# Altium schematic sheet Sensors5V.SchDoc
size A; SheetNumber: 3; SheetTotal: 5
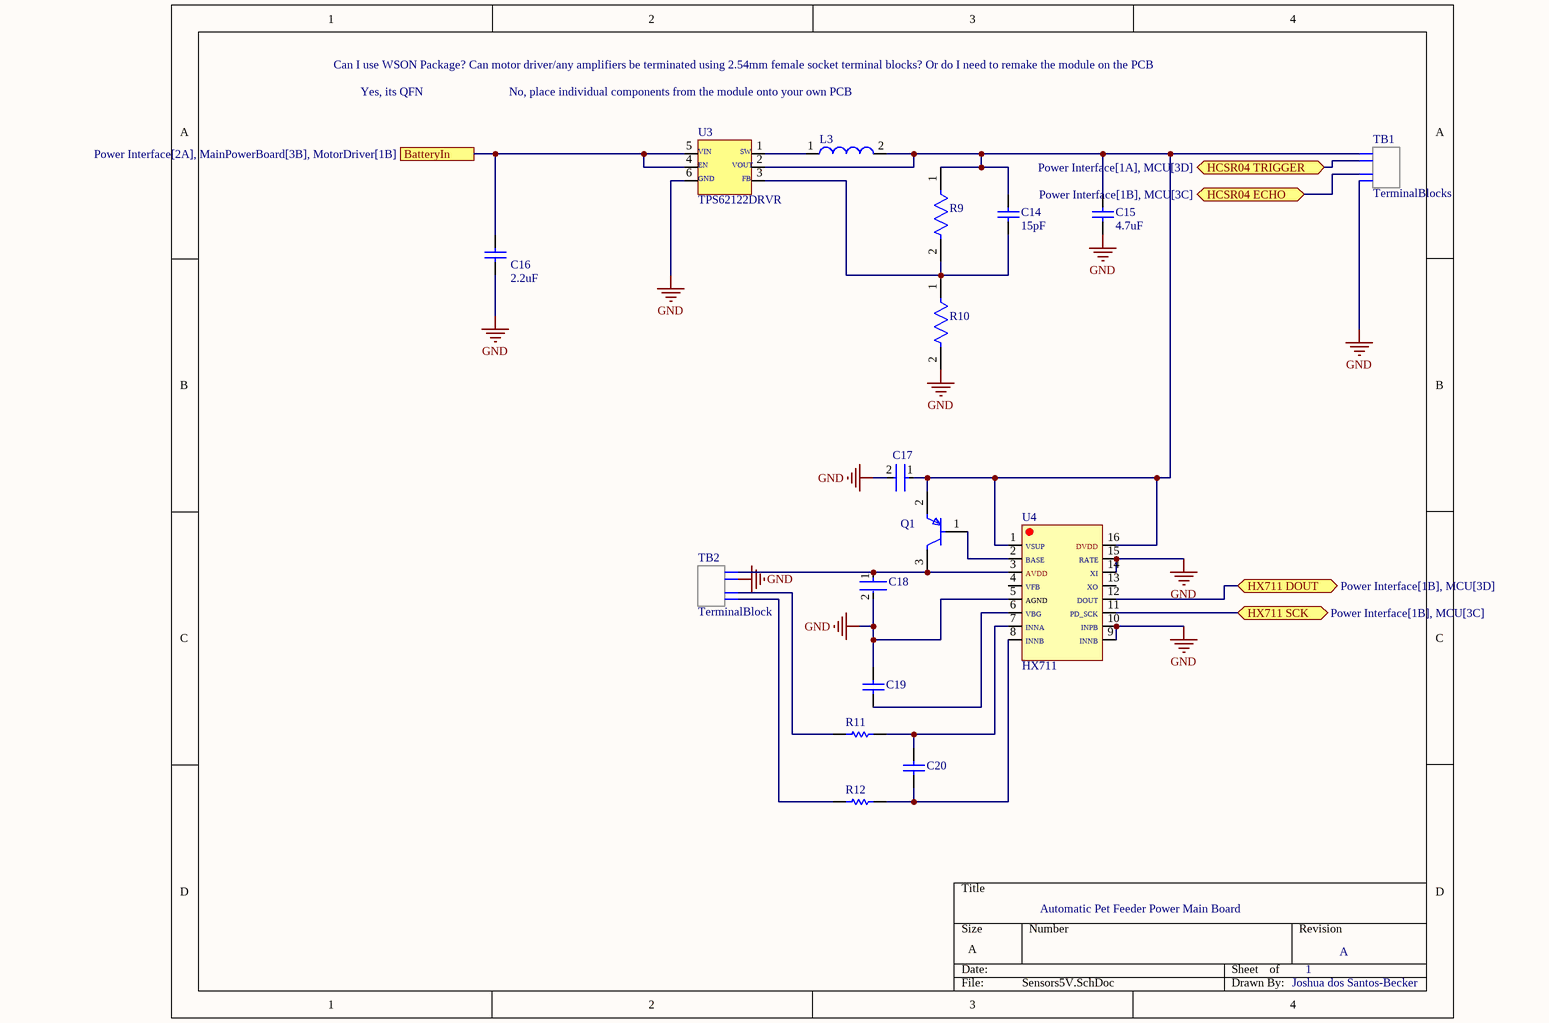
[diagram p0: Sensors5V.SchDoc]

## Parts
C14  15pF  [CAP_0805]
C15  4.7uF  [CAPC1005X06N]
C16  2.2uF  [CAPC0402X02N]
C17  GRM21BR61C106KE15L  [FP-GRM21B-0_1-IPC_C]  (value not drawn)
C18  GRM21BR61C106KE15L  [FP-GRM21B-0_1-IPC_C]  (value not drawn)
C19  GRM033C71C104KE14J  [CAPC0603X33N]  (value not drawn)
C20  GRM033C71C104KE14J  [CAPC0603X33N]  (value not drawn)
L3  (no value)  [FP-CB2012-IPC_A]
Q1  MMSS8550-H-TP  [FP-SOT-23-IPC_B]  (value not drawn)
R9  (no value)  [RESC0603(1608)_N]
R10  (no value)  [RESC1608X55X25LL10T15]
R11  ERJ-2RKF1000X  [RESC1005X40X25LL05T05]  (value not drawn)
R12  ERJ-2RKF1000X  [RESC1005X40X25LL05T05]  (value not drawn)
TB1  TerminalBlocks  [PHOENIX_1725672]
TB2  TerminalBlock  [PHOENIX_1725672]
U3  TPS62122DRVR  [PSON65P200X80_HS-7N]
U4  HX711  [TSOP127P600X160-16N]

## Ports
BatteryIn (see Power Interface[2A], MainPowerBoard[3B], MotorDriver[1B]), HCSR04 ECHO (bidir, see Power Interface[1B], MCU[3C]), HCSR04 TRIGGER (bidir, see Power Interface[1A], MCU[3D]), HX711 DOUT (bidir, see Power Interface[1B], MCU[3D]), HX711 SCK (bidir, see Power Interface[1B], MCU[3C])

## Nets
GND: C15.1 C16.1 C17.2 C18.2 C19.2 R10.2 TB1.4 TB2.3 U3.6 U4.5 U4.9 U4.10 U4.14 U4.15
BatteryIn: C16.2 U3.4 U3.5 ; port BatteryIn
HCSR04 ECHO: TB1.3 ; port HCSR04 ECHO
HCSR04 TRIGGER: TB1.2 ; port HCSR04 TRIGGER
HX711 DOUT: U4.12 ; port HX711 DOUT
HX711 SCK: U4.11 ; port HX711 SCK
NetC14_1: C14.1 R9.2 R10.1 U3.3
NetC14_2: C14.2 C15.2 C17.1 L3.2 Q1.2(E) R9.1 TB1.1 U3.2 U4.1 U4.16
NetC18_1: C18.1 Q1.3(C) TB2.4 U4.3
NetC19_1: C19.1 U4.6
NetC20_1: C20.1 R12.2 U4.8
NetC20_2: C20.2 R11.2 U4.7
NetL3_1: L3.1 U3.1
NetQ1_1: Q1.1(B) U4.2
NetR11_1: R11.1 TB2.2
NetR12_1: R12.1 TB2.1

Not connected (* = marked no-connect by the designer): U4 4 13

## Notes on the sheet
- Can I use WSON Package? Can motor driver/any amplifiers be terminated using 2.54mm female socket terminal blocks? Or do I need to remake the module on the PCB
- Yes, its QFN
- No, place individual components from the module onto your own PCB
- Automatic Pet Feeder Power Main Board
- 1
- A
- Joshua dos Santos-Becker
- (in symbol HX711) VSUP; DVDD; BASE; RATE; AVDD; XI; VFB; XO; AGND; DOUT; VBG; PD_SCK; INNA; INPB; INNB
- (in symbol TPS6212) VIN; SW; EN; VOUT; GND; FB

## Library data of the parts
C14 = Cff: CC0805JRNPO9BN150
C15 = Cout2: GRM155R61A475MEAAD
C16 = Cin2: C1005X5R1V225K050BC
C17 C18 = CMP-2007-03453-2: Chip Multilayer Ceramic Capacitors for General Purpose, 0805, 10uF, X5R, 15%, 10%, 16V; Radiation Hardening: No; Thickness: 0.053inch; Voltage Rating (DC): 16V; Lead Free: Lead Free; Package Quantity: 1; Width: 1.25mm; Case Code (Imperial): 0805; Depth: 1.25mm; Packaging: Tape and Reel; Dielectric: X5R; Max Operating Temperature: 85°C; Tolerance: 10%; Voltage Rating: 16V; Voltage: 16V; Capacitance: 10uF; Height: 1.25mm; Case Code (Metric): 2012; Material: Ceramic; Mount: Surface Mount; Case/Package: 0805; REACH SVHC: No SVHC; Length: 2mm; Min Operating Temperature: -55°C; Termination: SMD/SMT
C19 C20 = 0.1uF: Manufacturer_Name: Murata Electronics; Geometry.Height: 0.33mm; Mouser Part Number: 81-GRM033C71C104KE4J; Mouser Price/Stock: https://www.mouser.co.uk/ProductDetail/Murata-Electronics/GRM033C71C104KE14J?qs=QzBtWTOodeU72T%252BpeIULSA%3D%3D; Manufacturer_Part_Number: GRM033C71C104KE14J; Datasheet Link: http://www.murata.com/~/media/webrenewal/support/library/catalog/products/capacitor/mlcc/c02e.pdf
L3 = L1: CBC2012T220M; Inductance: 22uH; Current Rating: 190mA; Self Resonant Frequency: 16MHz; DC Resistance (DCR): 4.81R; Tolerance: 20%; Max DC Current: 170mA; Shielding: Unshielded; Test Frequency: 2.52MHz; Core Material: Ferrite; Package Quantity: 3000; Height - Seated (Max): 0.057inch; Lead Free: Exempt; Width: 0.049inch; Length: 0.079inch; Max Operating Temperature: 105°C; Number of Pins: 2; Height: 1.25mm; Packaging: Tape and Reel; Saturation Current: 170mA; Mount: Surface Mount; Case Code (Metric): 2012; Series: CB; Halogen Free: Halogen Free; Min Operating Temperature: -40°C; Case Code (Imperial): 0805; Case/Package: 0805; Termination: SMD/SMT; RoHS Compliant: Yes; Resistor Type: Wirewound
Q1 = CMP-56214-000002-1: TRANS PNP 25V 1.5A SOT23; Emitter Base Voltage (VEBO): 1.6V; Collector Base Voltage (VCBO): 40V; Collector Emitter Saturation Voltage: 500mV; Max Power Dissipation: 625mW; Transition Frequency: 100MHz; Element Configuration: Single; hFE Min: 40; Polarity: PNP; Lead Free: Lead Free; Max Breakdown Voltage: 25V; Package Quantity: 1; Min Operating Temperature: -55°C; Case/Package: SOT-23; Max Collector Current: 1.5A; Mount: Surface Mount; Packaging: Tape and Reel; Collector Emitter Voltage (VCEO): 500mV; Max Operating Temperature: 150°C; Gain Bandwidth Product: 100MHz; Collector Emitter Breakdown Voltage: 25V
R9 = RES: RC0603FR-07430KL; Case-Metric: 1608; Power: 0.1 W; Case-EIA: 0603; Tolerance: 1 %; Value: 430000.00 Ohm; Technology: SMT
R10 = RES-2: RC0603FR-0782KL; Manufacturer: Yageo; Temperature Coefficient: 100PPM/C; Unit Weight: 0.000071oz; Voltage Rating: 75V; Resistance: 82kOhms; Power Rating: 100mW; Tolerance: 1%; Packaging: Reel; Package Description: 2-Pin Surface Mount Device, Body 1.6 x 0.8 mm; Package / Case: 0603(1608metric); Series: RC; Operating Temperature Range: -55Cto+155C; Brand: Yageo; Case Code - in: 0603; Width: 0.8mm; Height: 0.45mm; Product Category: ThickFilmResistors; Length: 1.6mm; Product: ThickFilmResistorsGeneralPurpose; Manufacturer URL: http://www.yageo.com/; Datasheet URL: http://www.yageo.com/documents/recent/PYu-RC_Group_51_RoHS_L_7.pdf; RoHS: True; Datasheet Version: Rev. 7, 05/2017; Case Code - mm: 1608; Package Reference: 0603; Mounting Technology: SurfaceMount; Type: GeneralPurposeChipResistorSurfaceMount; Termination Style: SMD/SMT
R11 R12 = CMP-2002-00605-3: Chip Resistor, 100 Ohm, +/- 1%, 100 mW, -55 to 155 degC, 0402 (1005 Metric), RoHS, Tape and Reel; Manufacturer: Basic Passives; Power Rating: 100 mW; Resistance: 100 Ohm; Voltage Rating: 50 V; Case\/Package: 0402; Width: 0.5 mm; Pins: 2; ComponentLink2Description: Datasheet; PackageReference: 0402; Height: 0.35 mm; Tolerance: 1%; DatasheetVersion: 04/2015; Case Code (Imperial): 0402; Min Operating Temperature: -55 degC; Radiation Hardening: No; Length: 1 mm; Package Quantity: 10000; PackageDescription: 2-Pin Surface Mount Device, Body 1 x 0.5 mm; Mounting Technology: Surface Mount; Case Code (Metric): 1005; Packaging: Tape and Reel; ComponentLink1URL: http://www.panasonic.com/; RoHSCompliant: true; Max Operating Temperature: 155 degC; REACH SVHC: Yes; PartNumber: ERJ-2RKF1000X; ComponentLink1Description: Manufacturer URL; ComponentLink2URL: http://industrial.panasonic.com/cdbs/www-data/pdf/RDA0000/AOA0000C86.pdf; Mount: Surface Mount
TB1 = TerminalBlock
U3 = TPS6212